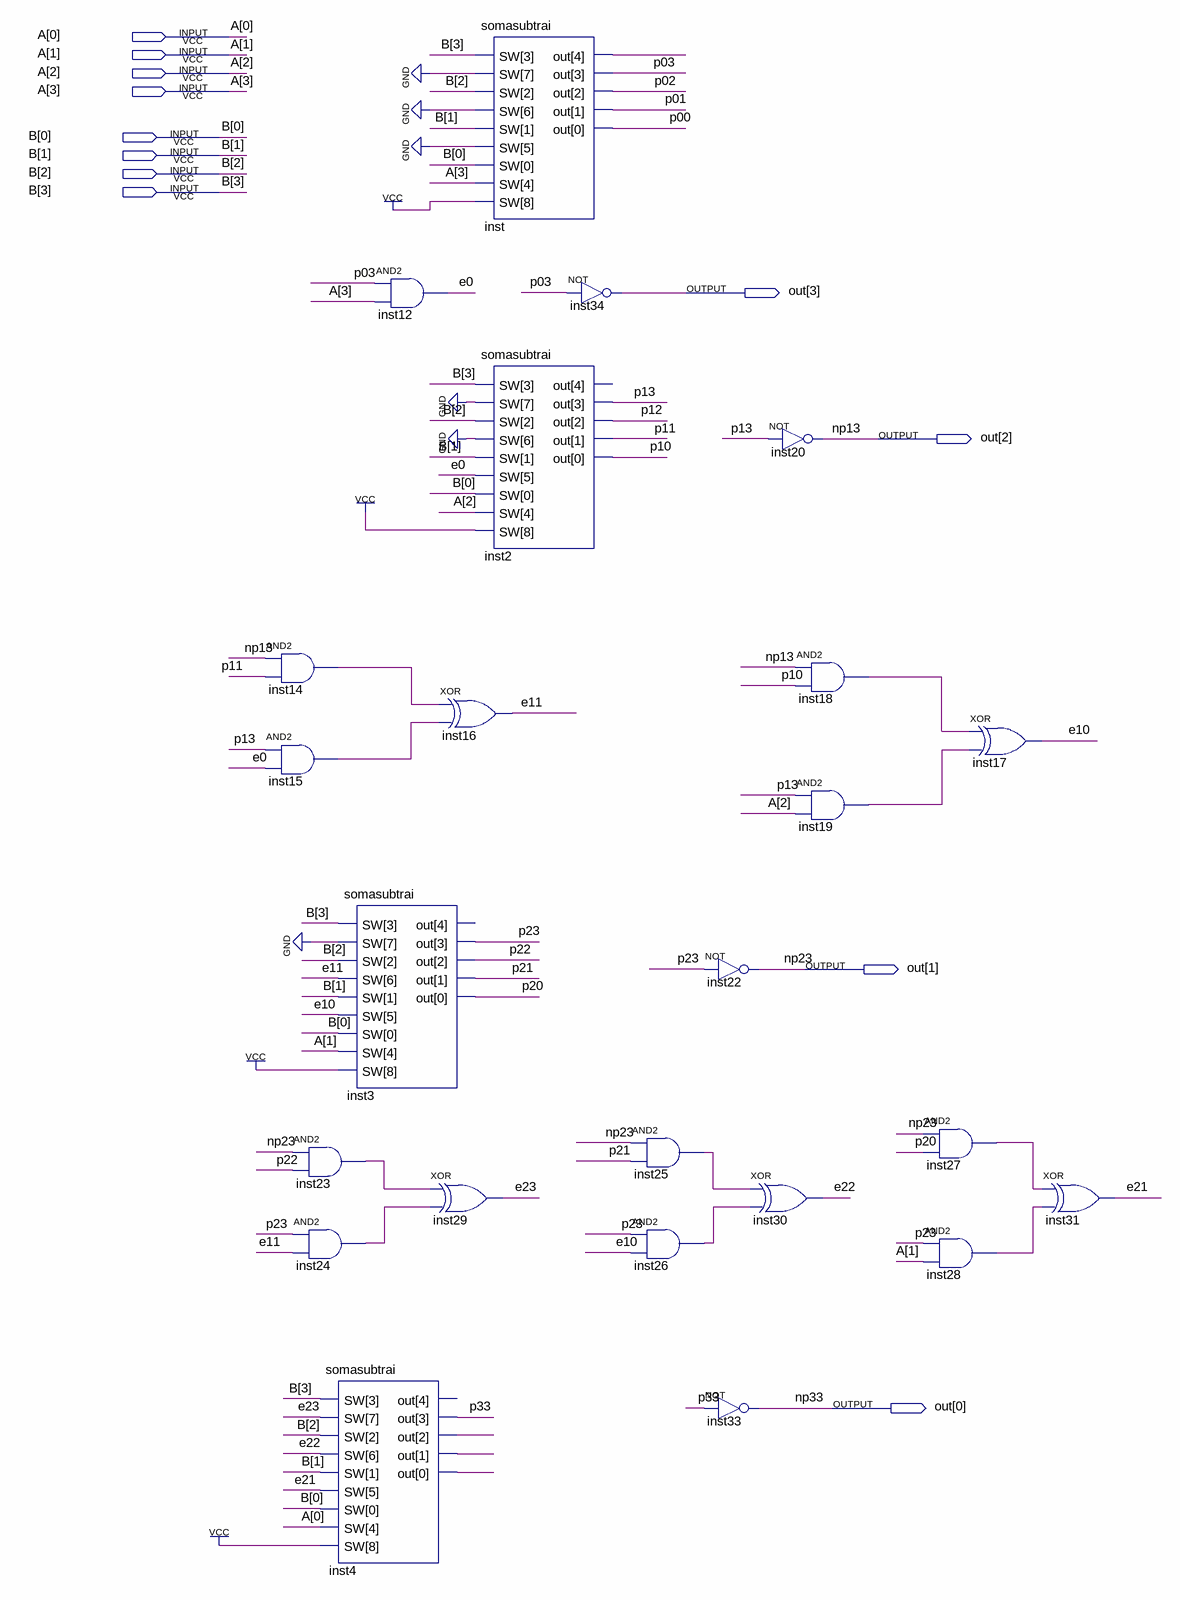
[diagram p0: schematic sheet]
// Quartus schematic Divisor.bdf as structural Verilog: 24 symbols, 12 pins
module Divisor (
  input  [3:0] A,
  input  [3:0] B,
  output [3:0] out
);

  wire e0, e10, e11, e21, e22, e23, inst4_out, inst4_out_2, inst4_out_3, inst14_out, inst15_out, inst18_out,
       inst19_out, inst23_out, inst24_out, inst25_out, inst26_out, inst27_out, inst28_out, inst_out, p00,
       p01, p02, p03, p10, p11, p12, p13, p20, p21, p22, p23, p33;
  wire [4:0] inst2_out_open;  // unused outputs
  wire [4:0] inst4_out_open;  // unused outputs
  wire [4:0] inst3_out_open;  // unused outputs

  and inst14 (inst14_out, out[2], p11);
  and inst15 (inst15_out, p13, e0);
  and inst23 (inst23_out, out[1], p22);
  and inst24 (inst24_out, p23, e11);
  somasubtrai inst3 (.SW({2'b10, e11, e10, A[1], B}), .out({inst3_out_open[4], p23, p22, p21, p20}));
  somasubtrai inst4 (
    .SW({1'b1, e23, e22, e21, A[0], B}), .out({inst4_out_open[4], p33, inst4_out, inst4_out_2, inst4_out_3}));
  and inst12 (e0, p03, A[3]);
  xor inst16 (e11, inst14_out, inst15_out);
  xor inst29 (e23, inst23_out, inst24_out);
  somasubtrai inst (.SW({4'b1000, A[3], B}), .out({inst_out, p03, p02, p01, p00}));
  somasubtrai inst2 (.SW({3'b100, e0, A[2], B}), .out({inst2_out_open[4], p13, p12, p11, p10}));
  not inst34 (out[3], p03);
  and inst25 (inst25_out, out[1], p21);
  and inst26 (inst26_out, p23, e10);
  not inst22 (out[1], p23);
  not inst33 (out[0], p33);
  not inst20 (out[2], p13);
  and inst18 (inst18_out, out[2], p10);
  and inst19 (inst19_out, p13, A[2]);
  xor inst30 (e22, inst25_out, inst26_out);
  and inst27 (inst27_out, out[1], p20);
  and inst28 (inst28_out, p23, A[1]);
  xor inst17 (e10, inst18_out, inst19_out);
  xor inst31 (e21, inst27_out, inst28_out);

  // Other names for the same wires on the sheet: np13 = out[2]; np23 = out[1]; np33 = out[0]
endmodule
